# Altium schematic sheet 3.3V_Converter.SchDoc
size A; SheetNumber: 2; SheetTotal: 8
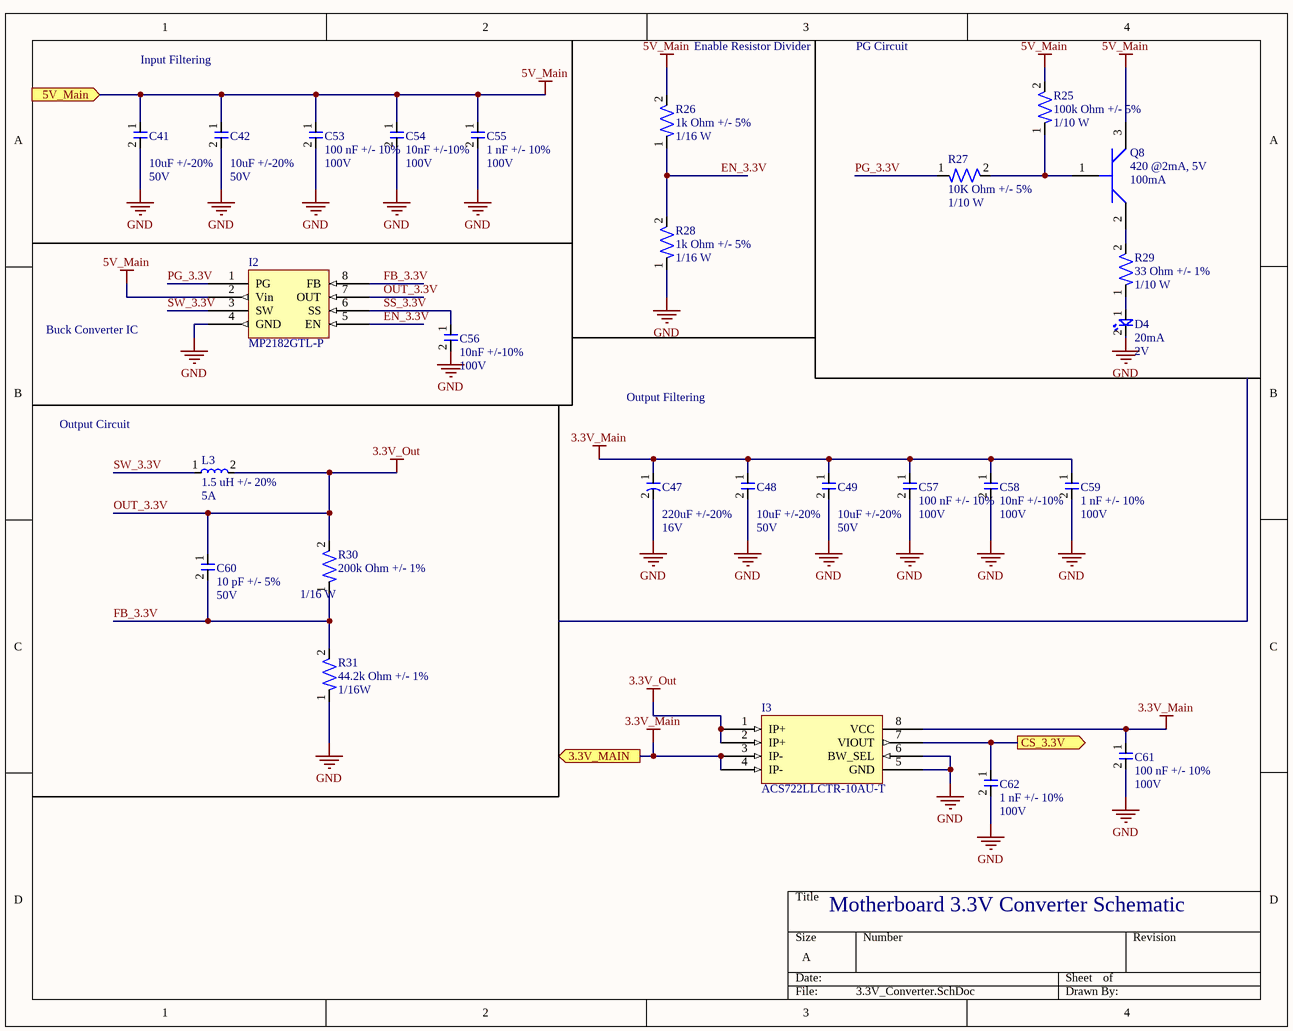
[diagram p0: 3.3V_Converter.SchDoc]

## Parts
C41  Capacitance: 10uF +/-20%  Voltage Rating: 50V  [CAP-1206]  (hidden comment: CL31B106KBHNNNE)
C42  Capacitance: 10uF +/-20%  Voltage Rating: 50V  [CAP-1206]  (hidden comment: CL31B106KBHNNNE)
C47  Capacitance: 220uF +/-20%  Voltage Rating: 16V  [ELEC-220U-0001]  (hidden comment: UUD1C221MCL1GS)
C48  Capacitance: 10uF +/-20%  Voltage Rating: 50V  [CAP-1206]  (hidden comment: CL31B106KBHNNNE)
C49  Capacitance: 10uF +/-20%  Voltage Rating: 50V  [CAP-1206]  (hidden comment: CL31B106KBHNNNE)
C53  Capacitance: 100 nF +/- 10%  Voltage: 100V  [CAP-0603]  (hidden comment: CC0603KRX7R0BB104)
C54  Capacitance: 10nF +/-10%  Voltage Rating: 100V  [CAP-0603]  (hidden comment: CC0603KRX7R0BB103)
C55  Capacitance: 1 nF +/- 10%  Voltage: 100V  [CAP-0402]  (hidden comment: C0402C102K1GECAUTO)
C56  Capacitance: 10nF +/-10%  Voltage Rating: 100V  [CAP-0603]  (hidden comment: CC0603KRX7R0BB103)
C57  Capacitance: 100 nF +/- 10%  Voltage: 100V  [CAP-0603]  (hidden comment: CC0603KRX7R0BB104)
C58  Capacitance: 10nF +/-10%  Voltage Rating: 100V  [CAP-0603]  (hidden comment: CC0603KRX7R0BB103)
C59  Capacitance: 1 nF +/- 10%  Voltage: 100V  [CAP-0402]  (hidden comment: C0402C102K1GECAUTO)
C60  Capacitance: 10 pF +/- 5%  Voltage Rating: 50V  [CAP-0402]  (hidden comment: CC0402JRNPO9BN100)
C61  Capacitance: 100 nF +/- 10%  Voltage: 100V  [CAP-0603]  (hidden comment: CC0603KRX7R0BB104)
C62  Capacitance: 1 nF +/- 10%  Voltage: 100V  [CAP-0402]  (hidden comment: C0402C102K1GECAUTO)
D4  Current Rating: 20mA  Vf: 2V  [LED-0603]  (hidden comment: 150060AS75000)
I2  MP2182GTL-P  [IC-SOT583]
I3  ACS722LLCTR-10AU-T  [IC-CURRENT-0001]
L3  Inductance: 1.5 uH +/- 20%  Saturation Current: 5A  [IND-1210]  (hidden comment: SRP3212-1R5M)
Q8  hFE: 420 @2mA, 5V  Ic: 100mA  [NPN-420-0001]  (hidden comment: BC847C,235)
R25  Resistance: 100k Ohm +/- 5%  Power: 1/10 W  [RES-0402]  (hidden comment: ERJ2GEJ104X)
R26  Resistance: 1k Ohm +/- 5%  Power: 1/16 W  [RES-0402]  (hidden comment: RC0402FR-071KL)
R27  Resistance: 10K Ohm +/- 5%  Power: 1/10 W  [RES-0402]  (hidden comment: ERJ2GEJ103X)
R28  Resistance: 1k Ohm +/- 5%  Power: 1/16 W  [RES-0402]  (hidden comment: RC0402FR-071KL)
R29  Resistance: 33 Ohm +/- 1%  Power: 1/10 W  [RES-0402]  (hidden comment: ERJ2RKF33R0X)
R30  Resistance: 200k Ohm +/- 1%  Power: 1/16 W  [RES-0402]  (hidden comment: RC-02W2003FT)
R31  Resistance: 44.2k Ohm +/- 1%  Power: 1/16W  [RES-0402]  (hidden comment: RC0402FR-0744K2L)

## Ports
3.3V_MAIN (out), 5V_Main (in), CS_3.3V (out)

## Nets
3.3V_Main: C47.1 C48.1 C49.1 C57.1 C58.1 C59.1 C61.1 I3.3(IP-) I3.4(IP-) I3.8(VCC) ; port 3.3V_MAIN
5V_Main: C41.1 C42.1 C53.1 C54.1 C55.1 I2.2(Vin) Q8.3 R25.2 R26.2 ; port 5V_Main
GND: C41.2 C42.2 C47.2 C48.2 C49.2 C53.2 C54.2 C55.2 C56.2 C57.2 C58.2 C59.2 C61.2 C62.2 D4.2 I2.4(GND) I3.5(GND) I3.6(BW_SEL) R28.1 R31.1
OUT_3.3V: C60.1 I2.7(OUT) I3.1(IP+) I3.2(IP+) L3.2 R30.2  [also labelled 3.3V_Out]
CS_3.3V: C62.1 I3.7(VIOUT) ; port CS_3.3V
EN_3.3V: I2.5(EN) R26.1 R28.2
FB_3.3V: C60.2 I2.8(FB) R30.1 R31.2
PG_3.3V: I2.1(PG) R27.1
SS_3.3V: C56.1 I2.6(SS)
SW_3.3V: I2.3(SW) L3.1
NetD4_1: D4.1 R29.1
NetQ8_1: Q8.1 R25.1 R27.2
NetQ8_2: Q8.2 R29.2

## Notes on the sheet
- Input Filtering
- Enable Resistor Divider
- PG Circuit
- Buck Converter IC
- Output Circuit
- Output Filtering
- Motherboard 3.3V Converter Schematic

## Library data of the parts
C41 C42 C48 C49 = CAP-10U-0001: 10 µF ±10% 50V Ceramic Capacitor X7R 1206 (3216 Metric); Manufacturer: Samsung Electro-Mechanics; Assembled?: no; Manufacturer Part Number: CL31B106KBHNNNE; Temperature Coefficient: X7R; Package Size: 1206
C47 = ELEC-220U-0001: 220 µF 16 V Aluminum Electrolytic Capacitors Radial, Can - SMD 2000 Hrs @ 105°C; Manufacturer: Nichicon; Assembled?: no; Manufacturer Part Number: UUD1C221MCL1GS
C53 C57 C61 = CAP-100N-0002-JLC: 100V 100nF X7R ±10% 0603 Multilayer Ceramic Capacitors MLCC - SMD/SMT ROHS; assembled?: yes; JLC Part Number: C113803
C54 C56 C58 = CAP-10N-0003-JLC: 100V 10nF X7R ±10% 0603 Multilayer Ceramic Capacitors MLCC - SMD/SMT ROHS; Manufacturer: Yageo; Assembled?: yes; Manufacturer Part Number: CC0603KRX7R0BB103; Temperature Coefficient: X7R; Package Size: 0603; JLC Part Number: C107059
C55 C59 C62 = CAP-1N-0004-JLC: 100V 1nF C0G ±10% 0402 Multilayer Ceramic Capacitors MLCC - SMD/SMT ROHS; assembled?: yes; JLC part number: C696348
C60 = CAP-10P-0002-JLC: 50V 10pF NP0 ±5% 0402 Multilayer Ceramic Capacitors MLCC - SMD/SMT ROHS; Manufacturer: Yageo; Temperature Coefficient: C0G, NP0; Assembled?: Yes; Manufacturer Part Number: CC0402JRNPO9BN100; Package Size: 0402; JLC Part Number: C106199
D4 = LED_Amber_0001: CAP CER 0.1UF 100V X7R 0603; Manufacturer: Wurth Electronik; Assembled?: no; Color: Amber; Manufacturer Part Number: 150060AS75000; Package Size: 0603
I2 = IC-BUCK-0003: Buck Switching Regulator IC Positive Adjustable 0.6V 1 Output 2A SOT-583; Manufacturer: Monolithic Power Systems; Assembled?: no; VCC-Max: 5.5V; VCC-Min: 2.5V; Vout-Tolerance: +/-1%; Fsw: 1.2MHz; Manufacturer Part Number: MP2182GTL-P; Type: Buck; Package: SOT-583; Vout-Max: 5.5V; Vout-Min: 0.6V; Output Current-Max: 2A
I3 = IC-CURRENT-0001: Current Sensor 10A 1 Channel Hall Effect, Open Loop Unidirectional 8-SOIC (0.154", 3.90mm Width)
L3 = PWRIND-1.5U-0001: 1.5 µH Shielded Drum Core, Wirewound Inductor 4.4 A 53mOhm Max 1210 (3225 Metric); Manufacturer: Bourns Inc.; Assembled?: Yes; Manufacturer Part Number: SRP3212-1R5M; Package Size: 1210; DC Resistance: 53 mOhm
Q8 = BJT-420-0001: Bipolar (BJT) Transistor NPN 45 V 100 mA 100MHz 250 mW Surface Mount TO-236AB; VCEO: 45V; Transistor type: NPN; Package: TO-236AB
R25 = RES-100K-0002-JLC: 100mW Thick Film Resistors ±5% ±200ppm/℃ -55℃~+155℃ 100kΩ 0402  Chip Resistor - Surface Mount ROHS; assembled?: yes; JLC part number: C413017
R26 R28 = RES-1K-0003-JLC: 62.5mW Thick Film Resistors 50V ±100ppm/℃ ±1% -55℃~+155℃ 1kΩ 0402 Chip Resistor - Surface Mount ROHS; assembled?: yes; JLC Part Number: C106235
R27 = RES-10K-0003-JLC: 100mW Thick Film Resistors 100V ±5% ±200ppm/℃ -55℃~+155℃ 10kΩ 0402  Chip Resistor - Surface Mount ROHS; assembled?: yes; JLC part number: C278577
R29 = RES-33-0003-JLC: 100mW Thick Film Resistors ±100ppm/℃ ±1% -55℃~+155℃ 33Ω 0402  Chip Resistor - Surface Mount ROHS; assembled?: yes; JLC part number: C278594
R30 = RES-200K-0002-JLC: 62.5mW 50V ±1% ±200ppm/℃ -55℃~+155℃ 200kΩ 0402  Chip Resistor - Surface Mount ROHS; assembled?: yes; JLC part number: C258094
R31 = RES-44.2K-0002-JLC: 62.5mW Thick Film Resistors 50V ±100ppm/℃ ±1% -55℃~+155℃ 44.2kΩ 0402  Chip Resistor - Surface Mount ROHS; assembled?: yes; JLC part number: C354260